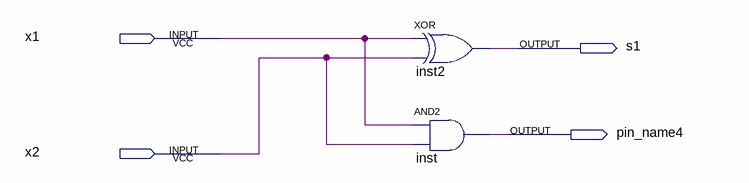
[diagram p0: schematic sheet]
// Quartus schematic Additionneur.bdf as structural Verilog: 2 symbols, 4 pins
module Additionneur (
  input  x1,
  input  x2,
  output s1,
  output pin_name4
);

  xor inst2 (s1, x1, x2);
  and inst (pin_name4, x1, x2);
endmodule
